# EAGLE schematic rat (EAGLE 6.3)
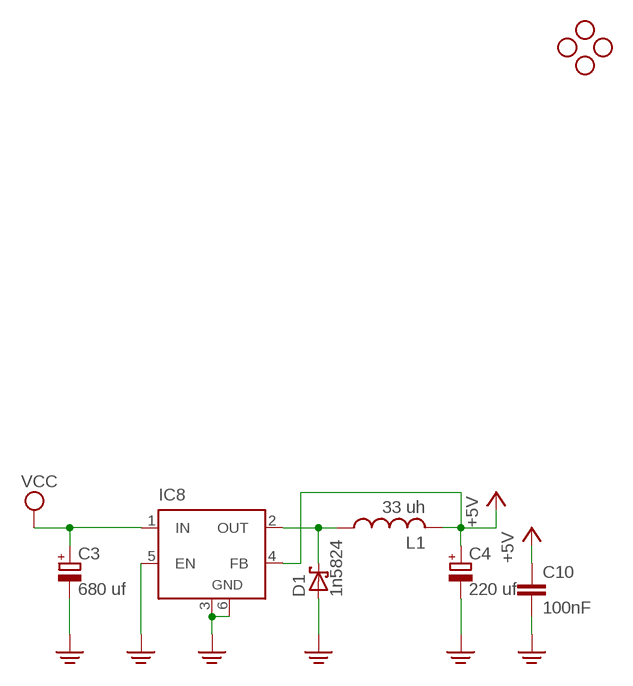
[diagram p0: schematic, sheet 1, part 1 of 2]
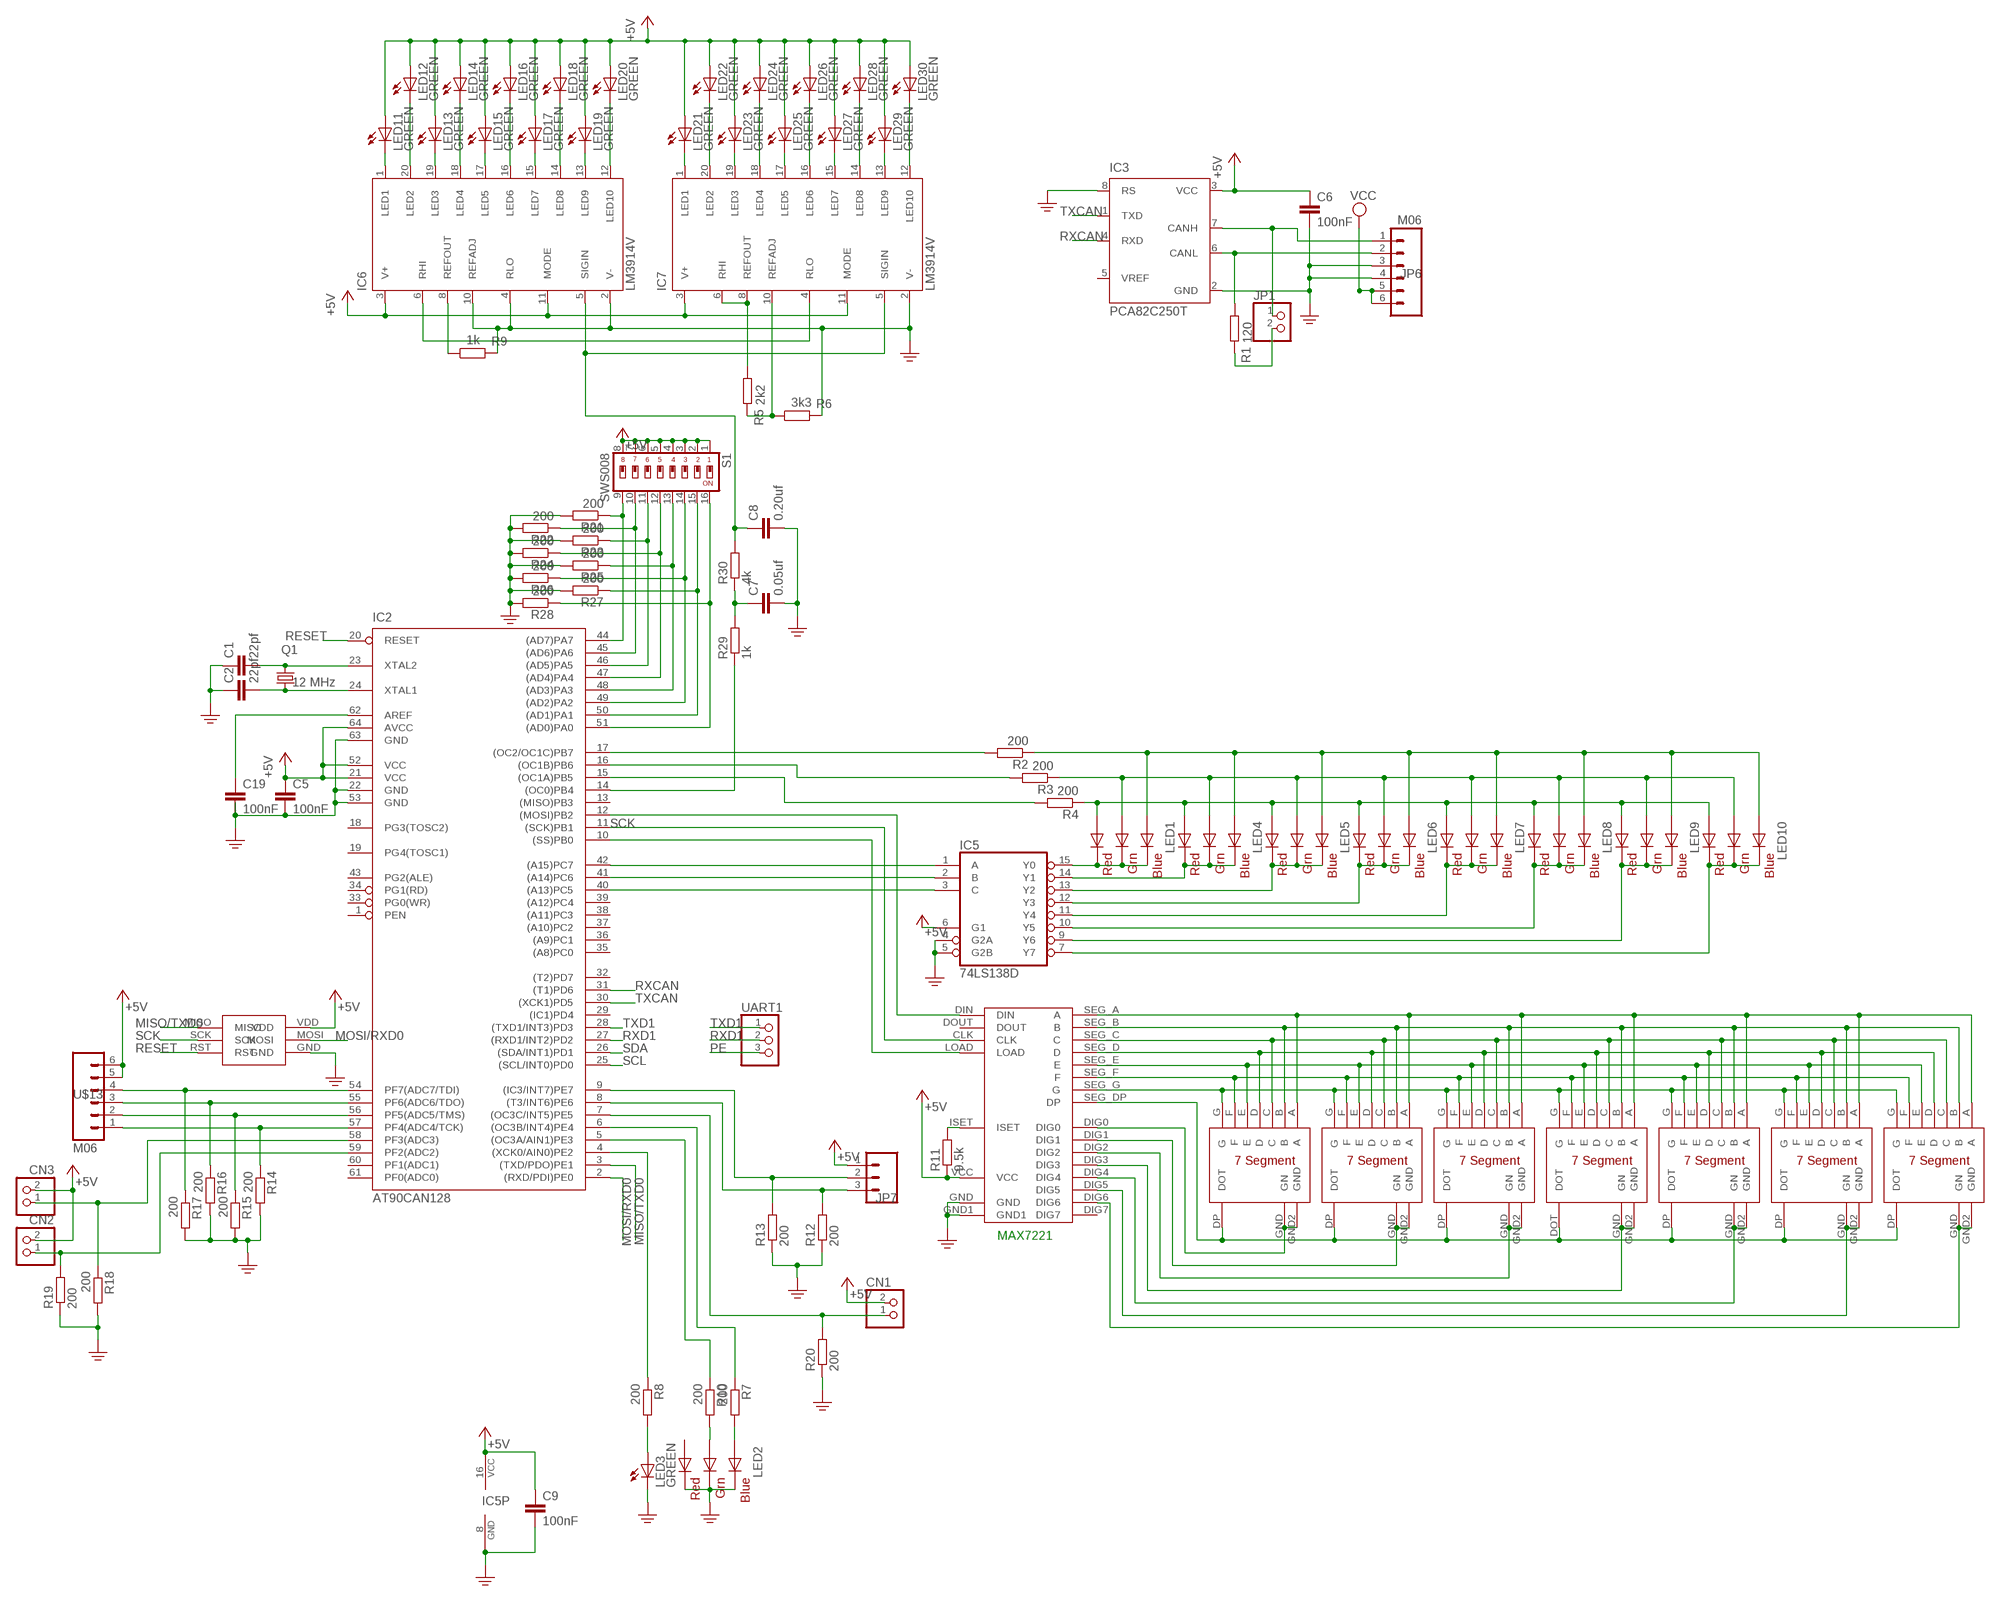
[diagram p1: schematic, sheet 1, part 2 of 2]

## Parts
C1  22pf  C-EUC0603K  [C0603K]
C2  22pf  C-EUC0603K  [C0603K]
C3  680 uf  CPOL-EUE5-10.5  [E5-10,5]
C4  220 uf  CPOL-EUE2.5-7  [E2,5-7]
C5  100nF  C-EUC0603K  [C0603K]
C6  100nF  C-EUC0603K  [C0603K]
C7  0.05uf  C-EUC0603K  [C0603K]
C8  0.20uf  C-EUC0603K  [C0603K]
C9  100nF  C-EUC0603K  [C0603K]
C10  100nF  C-EUC0603K  [C0603K]
C19  100nF  C-EUC0603K  [C0603K]
CN1  JST_2PIN-SMT-RA  [JST-PH-2-SMT-RA]
CN2  JST_2PIN-SMT-RA  [JST-PH-2-SMT-RA]
CN3  JST_2PIN-SMT-RA  [JST-PH-2-SMT-RA]
D1  1n5824  SCHOTTKY-DIODEP6T15  [P6T15]
IC2  AT90CAN128  MEGA128-A  [TQFP64]
IC3  PCA82C250T  [SO8]
IC5  74LS138D  [SO16]
IC6  LM3914V  [PLCC20S]
IC7  LM3914V  [PLCC20S]
IC8  LM2596S  [TO263-5]
JP1  PINHD-1X2  [1X02]
JP2  STAND-OFF  [STAND-OFF]
JP3  STAND-OFF  [STAND-OFF]
JP4  STAND-OFF  [STAND-OFF]
JP5  STAND-OFF  [STAND-OFF]
JP6  M06  [S6B_PH]
JP7  M03  [S3B-PH]
L1  33 uh  L-USTFI0410  [TFI0410]
LED1  RGBLED5050  [RGBLED5050]
LED2  RGBLED5050  [RGBLED5050]
LED3  GREEN  LEDSMT1206  [1206]
LED4  RGBLED5050  [RGBLED5050]
LED5  RGBLED5050  [RGBLED5050]
LED6  RGBLED5050  [RGBLED5050]
LED7  RGBLED5050  [RGBLED5050]
LED8  RGBLED5050  [RGBLED5050]
LED9  RGBLED5050  [RGBLED5050]
LED10  RGBLED5050  [RGBLED5050]
LED11  GREEN  LEDSMT1206  [1206]
LED12  GREEN  LEDSMT1206  [1206]
LED13  GREEN  LEDSMT1206  [1206]
LED14  GREEN  LEDSMT1206  [1206]
LED15  GREEN  LEDSMT1206  [1206]
LED16  GREEN  LEDSMT1206  [1206]
LED17  GREEN  LEDSMT1206  [1206]
LED18  GREEN  LEDSMT1206  [1206]
LED19  GREEN  LEDSMT1206  [1206]
LED20  GREEN  LEDSMT1206  [1206]
LED21  GREEN  LEDSMT1206  [1206]
LED22  GREEN  LEDSMT1206  [1206]
LED23  GREEN  LEDSMT1206  [1206]
LED24  GREEN  LEDSMT1206  [1206]
LED25  GREEN  LEDSMT1206  [1206]
LED26  GREEN  LEDSMT1206  [1206]
LED27  GREEN  LEDSMT1206  [1206]
LED28  GREEN  LEDSMT1206  [1206]
LED29  GREEN  LEDSMT1206  [1206]
LED30  GREEN  LEDSMT1206  [1206]
Q1  12 MHz  CRYSTALHC49U70  [HC49U70]
R1  120  R-EU_R0603  [R0603]
R2  200  R-EU_R0603  [R0603]
R3  200  R-EU_R0603  [R0603]
R4  200  R-EU_R0603  [R0603]
R5  2k2  R-EU_R0603  [R0603]
R6  3k3  R-EU_R0603  [R0603]
R7  200  R-EU_R0603  [R0603]
R8  200  R-EU_R0603  [R0603]
R9  1k  R-EU_R0603  [R0603]
R10  200  R-EU_R0603  [R0603]
R11  9.5k  R-EU_R0603  [R0603]
R12  200  R-EU_R0603  [R0603]
R13  200  R-EU_R0603  [R0603]
R14  200  R-EU_R0603  [R0603]
R15  200  R-EU_R0603  [R0603]
R16  200  R-EU_R0603  [R0603]
R17  200  R-EU_R0603  [R0603]
R18  200  R-EU_R0603  [R0603]
R19  200  R-EU_R0603  [R0603]
R20  200  R-EU_R0603  [R0603]
R21  200  R-EU_R0603  [R0603]
R22  200  R-EU_R0603  [R0603]
R23  200  R-EU_R0603  [R0603]
R24  200  R-EU_R0603  [R0603]
R25  200  R-EU_R0603  [R0603]
R26  200  R-EU_R0603  [R0603]
R27  200  R-EU_R0603  [R0603]
R28  200  R-EU_R0603  [R0603]
R29  1k  R-EU_R0603  [R0603]
R30  4k  R-EU_R0603  [R0603]
S1  SWS008  [SMS-008]
U$2  REDSEVENSEGMENT  [REDSEGMENT]
U$3  REDSEVENSEGMENT  [REDSEGMENT]
U$4  REDSEVENSEGMENT  [REDSEGMENT]
U$5  BIGSEVENSEGMENT  [BIGSEVENSEGMENT]
U$6  REDSEVENSEGMENT  [REDSEGMENT]
U$7  REDSEVENSEGMENT  [REDSEGMENT]
U$8  REDSEVENSEGMENT  [REDSEGMENT]
U$9  ISP-HEADER  [ISP-HEADER]
U$13  M06  [S6B_PH]
U$14  MAX7221-SMD  [MAX7221]
UART1  PINHD-1X3  [1X03]

## Nets
+5V: C4.+ C5.1 C6.1 C9.1 C10.1 CN1.2 CN2.2 CN3.2 IC2.21(VCC) IC2.52(VCC) IC2.64(AVCC) IC3.3(VCC) IC5.6(G1) IC5.16(VCC) IC6.3(V+) IC6.11(MODE) IC7.3(V+) IC7.11(MODE) IC8.4(FB) JP7.1 L1.2 LED11.A LED12.A LED13.A LED14.A LED15.A LED16.A LED17.A LED18.A LED19.A LED20.A LED21.A LED22.A LED23.A LED24.A LED25.A LED26.A LED27.A LED28.A LED29.A LED30.A R11.1 S1.1 S1.2 S1.3 S1.4 S1.5 S1.6 S1.7 S1.8 U$9.VDD U$13.5 U$13.6 U$14.VCC
CANJUMP1: IC3.7(CANH) JP1.1 JP6.1
CANJUMP2: JP1.2 R1.2
MISO/TXD0: IC2.3((TXD/PDO)PE1) U$9.MISO
MOSI/RXD0: IC2.2((RXD/PDI)PE0) U$9.MOSI
N$1: C2.2 IC2.24(XTAL1) Q1.1
N$2: C1.2 IC2.23(XTAL2) Q1.2
N$3: U$2.A U$3.A U$4.A U$5.A U$6.A U$7.A U$8.A U$14.SEG_A(A)
N$4: IC2.44((AD7)PA7) R21.1 S1.9
N$5: IC2.45((AD6)PA6) R22.1 S1.10
N$6: U$2.B U$3.B U$4.B U$5.B U$6.B U$7.B U$8.B U$14.SEG_B(B)
N$7: IC2.46((AD5)PA5) R23.1 S1.11
N$8: U$2.C U$3.C U$4.C U$5.C U$6.C U$7.C U$8.C U$14.SEG_C(C)
N$9: IC2.17((OC2/OC1C)PB7) R2.2
N$10: C19.1 IC2.62(AREF)
N$11: IC2.47((AD4)PA4) R24.1 S1.12
N$12: U$2.D U$3.D U$4.D U$5.D U$6.D U$7.D U$8.D U$14.SEG_D(D)
N$13: U$2.E U$3.E U$4.E U$5.E U$6.E U$7.E U$8.E U$14.SEG_E(E)
N$14: U$2.F U$3.F U$4.F U$5.F U$6.F U$7.F U$8.F U$14.SEG_F(F)
N$15: U$2.G U$3.G U$4.G U$5.G U$6.G U$7.G U$8.G U$14.SEG_G(G)
N$16: U$2.GND2(GND) U$2.GND(GN) U$14.DIG0
N$17: U$3.GND2(GND) U$3.GND(GN) U$14.DIG1
N$18: U$4.GND2(GND) U$4.GND(GN) U$14.DIG2
N$19: U$5.GND2(GND) U$5.GND(GN) U$14.DIG3
N$20: U$6.GND2(GND) U$6.GND(GN) U$14.DIG4
N$21: U$7.GND2(GND) U$7.GND(GN) U$14.DIG5
N$22: U$8.GND2(GND) U$8.GND(GN) U$14.DIG6
N$23: IC2.14((OC0)PB4) R29.1
N$24: IC2.6((OC3B/INT4)PE4) R7.1
N$25: U$2.DP(DOT) U$3.DP(DOT) U$4.DP(DOT) U$5.DOT U$6.DP(DOT) U$7.DP(DOT) U$8.DP(DOT) U$14.SEG_DP(DP)
N$26: C7.1 R29.2 R30.1
N$27: R11.2 U$14.ISET
N$28: IC2.12((MOSI)PB2) U$14.DIN
N$29: CN2.1 IC2.59(PF2(ADC2)) R19.2
N$30: LED1.2(RED_A) LED4.2(RED_A) LED5.2(RED_A) LED6.2(RED_A) LED7.2(RED_A) LED8.2(RED_A) LED9.2(RED_A) LED10.2(RED_A) R4.1
N$31: LED1.1(GREEN_A) LED4.1(GREEN_A) LED5.1(GREEN_A) LED6.1(GREEN_A) LED7.1(GREEN_A) LED8.1(GREEN_A) LED9.1(GREEN_A) LED10.1(GREEN_A) R3.1
N$32: LED1.3(BLUE_A) LED4.3(BLUE_A) LED5.3(BLUE_A) LED6.3(BLUE_A) LED7.3(BLUE_A) LED8.3(BLUE_A) LED9.3(BLUE_A) LED10.3(BLUE_A) R2.1
N$33: IC5.15(Y0) LED1.4(BLUE_C) LED1.5(RED_C) LED1.6(GREEN_C)
N$34: IC5.14(Y1) LED4.4(BLUE_C) LED4.5(RED_C) LED4.6(GREEN_C)
N$35: IC5.13(Y2) LED5.4(BLUE_C) LED5.5(RED_C) LED5.6(GREEN_C)
N$36: IC5.12(Y3) LED6.4(BLUE_C) LED6.5(RED_C) LED6.6(GREEN_C)
N$37: IC5.11(Y4) LED7.4(BLUE_C) LED7.5(RED_C) LED7.6(GREEN_C)
N$38: IC5.10(Y5) LED8.4(BLUE_C) LED8.5(RED_C) LED8.6(GREEN_C)
N$39: IC5.9(Y6) LED9.4(BLUE_C) LED9.5(RED_C) LED9.6(GREEN_C)
N$40: IC5.7(Y7) LED10.4(BLUE_C) LED10.5(RED_C) LED10.6(GREEN_C)
N$41: IC2.16((OC1B)PB6) R3.2
N$42: IC2.15((OC1A)PB5) R4.2
N$43: IC2.42((A15)PC7) IC5.1(A)
N$44: IC2.48((AD3)PA3) R25.1 S1.13
N$45: D1.C IC8.2(OUT) L1.1
N$46: IC2.49((AD2)PA2) R26.1 S1.14
N$47: IC2.50((AD1)PA1) R27.1 S1.15
N$48: IC6.1(LED1) LED11.C
N$49: IC6.20(LED2) LED12.C
N$50: IC6.19(LED3) LED13.C
N$51: IC3.6(CANL) JP6.2 R1.1
N$52: IC6.18(LED4) LED14.C
N$53: IC6.17(LED5) LED15.C
N$54: IC6.16(LED6) LED16.C
N$55: IC6.15(LED7) LED17.C
N$56: IC6.14(LED8) LED18.C
N$57: IC6.13(LED9) LED19.C
N$58: IC6.12(LED10) LED20.C
N$59: IC7.1(LED1) LED21.C
N$60: IC7.20(LED2) LED22.C
N$61: IC7.19(LED3) LED23.C
N$62: IC7.18(LED4) LED24.C
N$63: IC7.17(LED5) LED25.C
N$64: IC7.16(LED6) LED26.C
N$65: IC7.15(LED7) LED27.C
N$66: IC7.14(LED8) LED28.C
N$67: IC7.13(LED9) LED29.C
N$68: IC7.12(LED10) LED30.C
N$69: IC2.51((AD0)PA0) R28.1 S1.16
N$70: CN1.1 IC2.7((OC3C/INT5)PE5) R20.2
N$71: CN3.1 IC2.58(PF3(ADC3)) R18.1
N$72: IC6.6(RHI) IC7.4(RLO)
N$73: C8.1 IC6.5(SIGIN) IC7.5(SIGIN) R30.2
N$74: IC7.6(RHI) IC7.8(REFOUT) R5.1
N$75: IC7.10(REFADJ) R5.2 R6.1
N$76: IC6.8(REFOUT) R9.1
N$78: IC2.41((A14)PC6) IC5.2(B)
N$79: IC2.40((A13)PC5) IC5.3(C)
N$80: LED2.3(BLUE_A) R7.2
N$81: IC2.5((OC3A/AIN1)PE3) R10.1
N$82: IC2.10((SS)PB0) U$14.LOAD
N$83: IC2.57(PF4(ADC4/TCK)) R14.1 U$13.1
N$84: IC2.56(PF5(ADC5/TMS)) R15.1 U$13.2
N$85: IC2.55(PF6(ADC6/TDO)) R16.1 U$13.3
N$86: IC2.54(PF7(ADC7/TDI)) R17.1 U$13.4
N$87: LED2.1(GREEN_A) R10.2
N$88: LED3.A R8.2
N$89: IC2.4((XCK0/AIN0)PE2) R8.1
N$90: IC2.8((T3/INT6)PE6) JP7.3 R12.2
N$92: IC2.9((IC3/INT7)PE7) JP7.2 R13.2
PE: C1.1 C2.1 C3.- C4.- C5.2 C6.2 C7.2 C8.2 C9.2 C10.2 C19.2 D1.A IC2.22(GND) IC2.53(GND) IC2.63(GND) IC3.2(GND) IC3.8(RS) IC5.4(G2A) IC5.5(G2B) IC5.8(GND) IC6.2(V-) IC6.4(RLO) IC6.10(REFADJ) IC7.2(V-) IC8.3(GND) IC8.5(EN) IC8.6(GND) JP6.3 JP6.4 LED2.4(BLUE_C) LED2.5(RED_C) LED2.6(GREEN_C) LED3.C R6.2 R9.2 R12.1 R13.1 R14.2 R15.2 R16.2 R17.2 R18.2 R19.1 R20.1 R21.2 R22.2 R23.2 R24.2 R25.2 R26.2 R27.2 R28.2 U$9.GND U$14.GND U$14.GND1 UART1.3
RESET: IC2.20(RESET) U$9.RST
RXCAN: IC2.31((T1)PD6) IC3.4(RXD)
RXD1: IC2.27((RXD1/INT2)PD2) UART1.2
SCK: IC2.11((SCK)PB1) U$9.SCK U$14.CLK
SCL: IC2.25((SCL/INT0)PD0)
SDA: IC2.26((SDA/INT1)PD1)
TXCAN: IC2.30((XCK1)PD5) IC3.1(TXD)
TXD1: IC2.28((TXD1/INT3)PD3) UART1.1
VCC: C3.+ IC8.1(IN) JP6.5 JP6.6
Unconnected: IC2.1(PEN) IC2.13((MISO)PB3) IC2.18(PG3(TOSC2)) IC2.19(PG4(TOSC1)) IC2.29((IC1)PD4) IC2.32((T2)PD7) IC2.33(PG0(WR)) IC2.34(PG1(RD)) IC2.35((A8)PC0) IC2.36((A9)PC1) IC2.37((A10)PC2) IC2.38((A11)PC3) IC2.39((A12)PC4) IC2.43(PG2(ALE)) IC2.60(PF1(ADC1)) IC2.61(PF0(ADC0)) IC3.5(VREF) LED2.2(RED_A) U$14.DIG7 U$14.DOUT

## Notes on the sheet
- MAX7221

## Library data of the parts
C1 C2 C5-C10 C19 = rcl:C-EU: CAPACITOR, European symbol
C3 C4 = rcl:CPOL-EU: POLARIZED CAPACITOR, European symbol
CN1-CN3 = adafruit:JST_2PIN: JST 2-Pin Connectors of various flavors SMT-RA (S2B-PH-SM4) 4UConnector #17311 SMT (B2B-PH-SM4) THM-RA (S2B-PH) THM (B2B-PH)
D1 = diode:SCHOTTKY-DIODE: Schottky Diode
IC2 = atmel:MEGA128: MICROCONTROLLER 128 Kbytes FLASH 4 Kbytes SRAM 4 Kbytes EEPROM DUAL USART 8-channel 10 bit ADC Source: avr.lbr; MPN: ATMEGA128-16AU; OC_FARNELL: 9171118; OC_NEWARK: 95K7364
IC3 = micro-philips:PCA82C250: CAN CONTROLLER INTERFACE; OC_FARNELL: 1085275; OC_NEWARK: unknown
IC5 = 74xx-us:74*138: 3-line to 8-line DECODER/DEMULTIPLEXER
IC6 IC7 = national-semiconductor:LM391: Dot/Bar Display Driver Source: Data sheet LM3915 <http://www.national.com/ds/LM/LM3915.pdf> Data sheet LM3914 <http://www.national.com/ds/LM/LM3914.pdf>
IC8 = linear:LM2596S: STEP-DOWN VOLTAGE REGULATOR
JP1 = pinhead:PINHD-1X2: PIN HEADER
JP2-JP5 = SparkFun:STAND-OFF: Stand Off This is the mechanical footprint for a #4 phillips button head screw. Use the keepout ring to avoid running the screw head into surrounding components. SKU : PRT-00447
JP6 U$13 = unicorn_v2:M06
JP7 = unicorn_v2:M03: Header 2 Standard 2-pin 0.1" header. Use with straight break away headers (SKU : PRT-00116), right angle break away headers (PRT-00553), swiss pins (PRT-00743), machine pins (PRT-00117), and female headers (PRT-00115). Molex polarized connector foot print use with SKU : PRT-08233 with associated crimp pins and housings.
L1 = rcl:L-US: INDUCTOR, American symbol
LED1 LED2 LED4-LED10 = adafruit:RGBLED: For 5050 RGB LEDs, the order of the LEDs may vary from one manufacturer to another!
LED3 LED11-LED30 = led:LED: LED OSRAM: - CHIPLED LG R971, LG N971, LY N971, LG Q971, LY Q971, LO R971, LY R971 LH N974, LH R974 LS Q976, LO Q976, LY Q976 LO Q996 - Hyper CHIPLED LW Q18S LB Q993, LB Q99A, LB R99A - SideLED LS A670, LO A670, LY A670, LG A670, LP A670 LB A673, LV A673, LT A673, LW A673 LH A674 LY A675 LS A676, LA A676, LO A676, LY A676, LW A676 LS A679, LY A679, LG A679 - Hyper Micro SIDELED® LS Y876, LA Y876, LO Y876, LY Y876 LT Y87S - SmartLED LW L88C, LW L88S LB L89C, LB L89S, LG L890 LS L89K, LO L89K, LY L89K LS L896, LA L896, LO L896, LY L896 - TOPLED LS T670, LO T670, LY T670, LG T670, LP T670 LSG T670, LSP T670, LSY T670, LOP T670, LYG T670 LG T671, LOG T671, LSG T671 LB T673, LV T673, LT T673, LW T673 LH T674 LS T676, LA T676, LO T676, LY T676, LB T676, LH T676, LSB T676, LW T676 LB T67C, LV T67C, LT T67C, LS T67K, LO T67K, LY T67K, LW E67C LS E67B, LA E67B, LO E67B, LY E67B, LB E67C, LV E67C, LT E67C LW T67C LS T679, LY T679, LG T679 LS T770, LO T770, LY T770, LG T770, LP T770 LB T773, LV T773, LT T773, LW T773 LH T774 LS E675, LA E675, LY E675, LS T675 LS T776, LA T776, LO T776, LY T776, LB T776 LHGB T686 LT T68C, LB T68C - Hyper Mini TOPLED® LB M676 - Mini TOPLED Santana® LG M470 LS M47K, LO M47K, LY M47K Source: http://www.osram.convergy.de LUXEON: - LUMILED® LXK2-PW12-R00, LXK2-PW12-S00, LXK2-PW14-U00, LXK2-PW14-V00 LXK2-PM12-R00, LXK2-PM12-S00, LXK2-PM14-U00 LXK2-PE12-Q00, LXK2-PE12-R00, LXK2-PE12-S00, LXK2-PE14-T00, LXK2-PE14-U00 LXK2-PB12-K00, LXK2-PB12-L00, LXK2-PB12-M00, LXK2-PB14-N00, LXK2-PB14-P00, LXK2-PB14-Q00 LXK2-PR12-L00, LXK2-PR12-M00, LXK2-PR14-Q00, LXK2-PR14-R00 LXK2-PD12-Q00, LXK2-PD12-R00, LXK2-PD12-S00 LXK2-PH12-R00, LXK2-PH12-S00 LXK2-PL12-P00, LXK2-PL12-Q00, LXK2-PL12-R00 Source: www.luxeon.com KINGBRIGHT: KA-3528ASYC Source: www.kingbright.com; OSRAM-LGN971: GREEN
Q1 = crystal:CRYSTAL: CRYSTAL; OC_FARNELL: unknown; OC_NEWARK: unknown
R1 R5 R6 R9 = resistor:R-EU_: RESISTOR, European symbol
R2-R4 R7 R8 R10-R30 = rcl:R-EU_: RESISTOR, European symbol
S1 = smd-special:SWS008: SMD Dip Switch 8 pol.
U$2-U$4 U$6-U$8 = red_segment:REDSEVENSEGMENT
U$5 = red_segment:BIGSEVENSEGMENT
U$9 = ISP-Header:ISP-HEADER: 2 sided print edge ISP header connector
U$14 = max7221-smd:MAX7221-SMD
UART1 = pinhead:PINHD-1X3: PIN HEADER